# Altium schematic sheet BLOCK DIAGRAM.SchDoc
size A3; SheetNumber: 2; SheetTotal: 6
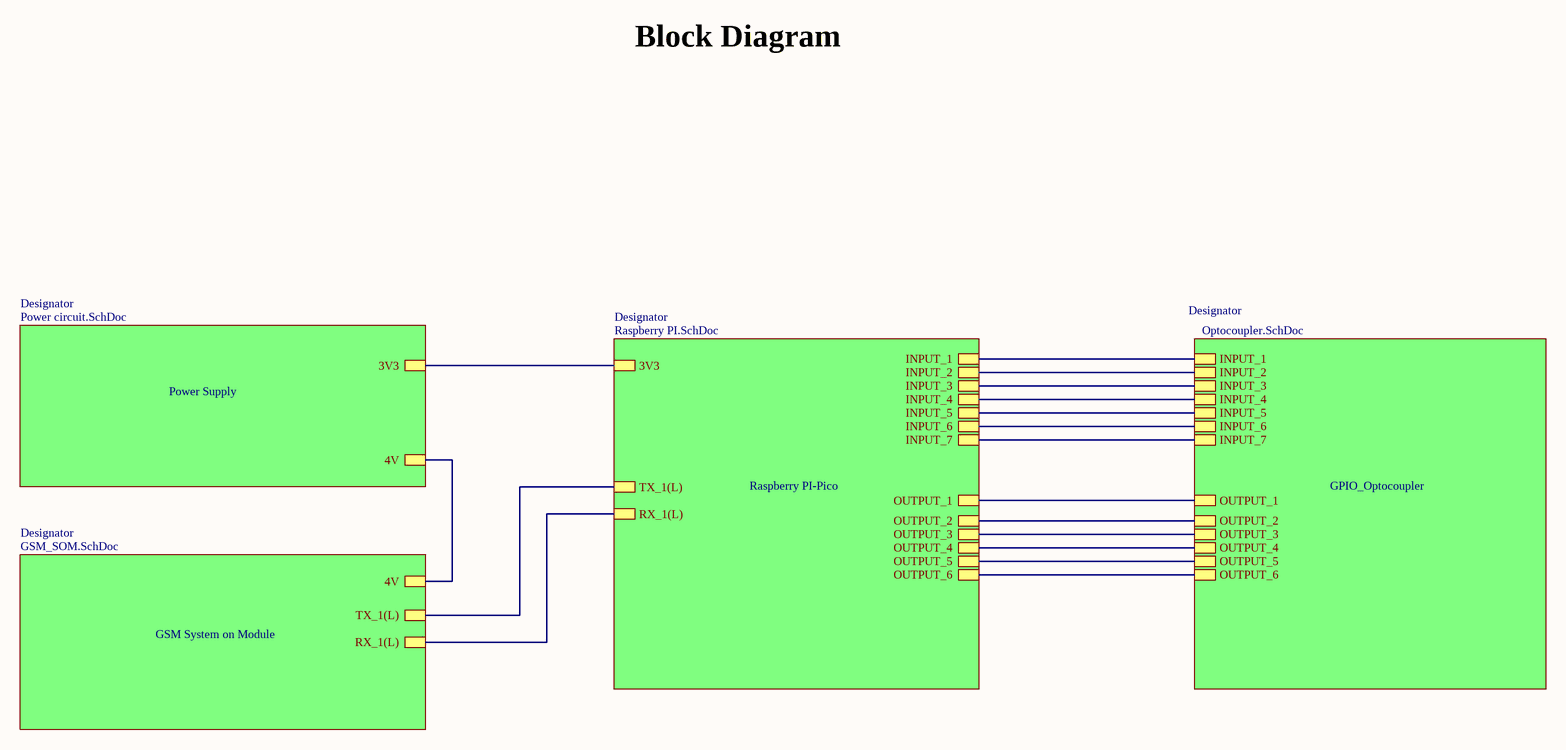
[diagram p0: BLOCK DIAGRAM.SchDoc]

## Sub-sheets
Designator = Raspberry PI.SchDoc: 3V3, INPUT_1, INPUT_2, INPUT_3, INPUT_4, INPUT_5, INPUT_6, INPUT_7, OUTPUT_1, OUTPUT_2, OUTPUT_3, OUTPUT_4, OUTPUT_5, OUTPUT_6, TX_1(L), RX_1(L)
Designator = Optocoupler.SchDoc: INPUT_1, INPUT_2, INPUT_3, INPUT_4, INPUT_5, INPUT_6, INPUT_7, OUTPUT_1, OUTPUT_2, OUTPUT_3, OUTPUT_4, OUTPUT_5, OUTPUT_6
Designator = Power circuit.SchDoc: 3V3, 4V
Designator = GSM_SOM.SchDoc: 4V, TX_1(L), RX_1(L)

## Nets
(unnamed): sheet Designator/3V3, sheet Designator/3V3
(unnamed): sheet Designator/INPUT_1, sheet Designator/INPUT_1
(unnamed): sheet Designator/INPUT_2, sheet Designator/INPUT_2
(unnamed): sheet Designator/INPUT_3, sheet Designator/INPUT_3
(unnamed): sheet Designator/INPUT_4, sheet Designator/INPUT_4
(unnamed): sheet Designator/INPUT_5, sheet Designator/INPUT_5
(unnamed): sheet Designator/INPUT_6, sheet Designator/INPUT_6
(unnamed): sheet Designator/INPUT_7, sheet Designator/INPUT_7
(unnamed): sheet Designator/OUTPUT_1, sheet Designator/OUTPUT_1
(unnamed): sheet Designator/OUTPUT_2, sheet Designator/OUTPUT_2
(unnamed): sheet Designator/OUTPUT_3, sheet Designator/OUTPUT_3
(unnamed): sheet Designator/OUTPUT_4, sheet Designator/OUTPUT_4
(unnamed): sheet Designator/OUTPUT_5, sheet Designator/OUTPUT_5
(unnamed): sheet Designator/OUTPUT_6, sheet Designator/OUTPUT_6
(unnamed): sheet Designator/TX_1(L), sheet Designator/TX_1(L)
(unnamed): sheet Designator/RX_1(L), sheet Designator/RX_1(L)
(unnamed): sheet Designator/4V, sheet Designator/4V

## Notes on the sheet
- Block Diagram
- Power Supply
- Raspberry PI-Pico
- GPIO_Optocoupler
- GSM System on Module